# EAGLE design mother_board_PLA_4 (EAGLE 9.0.0)
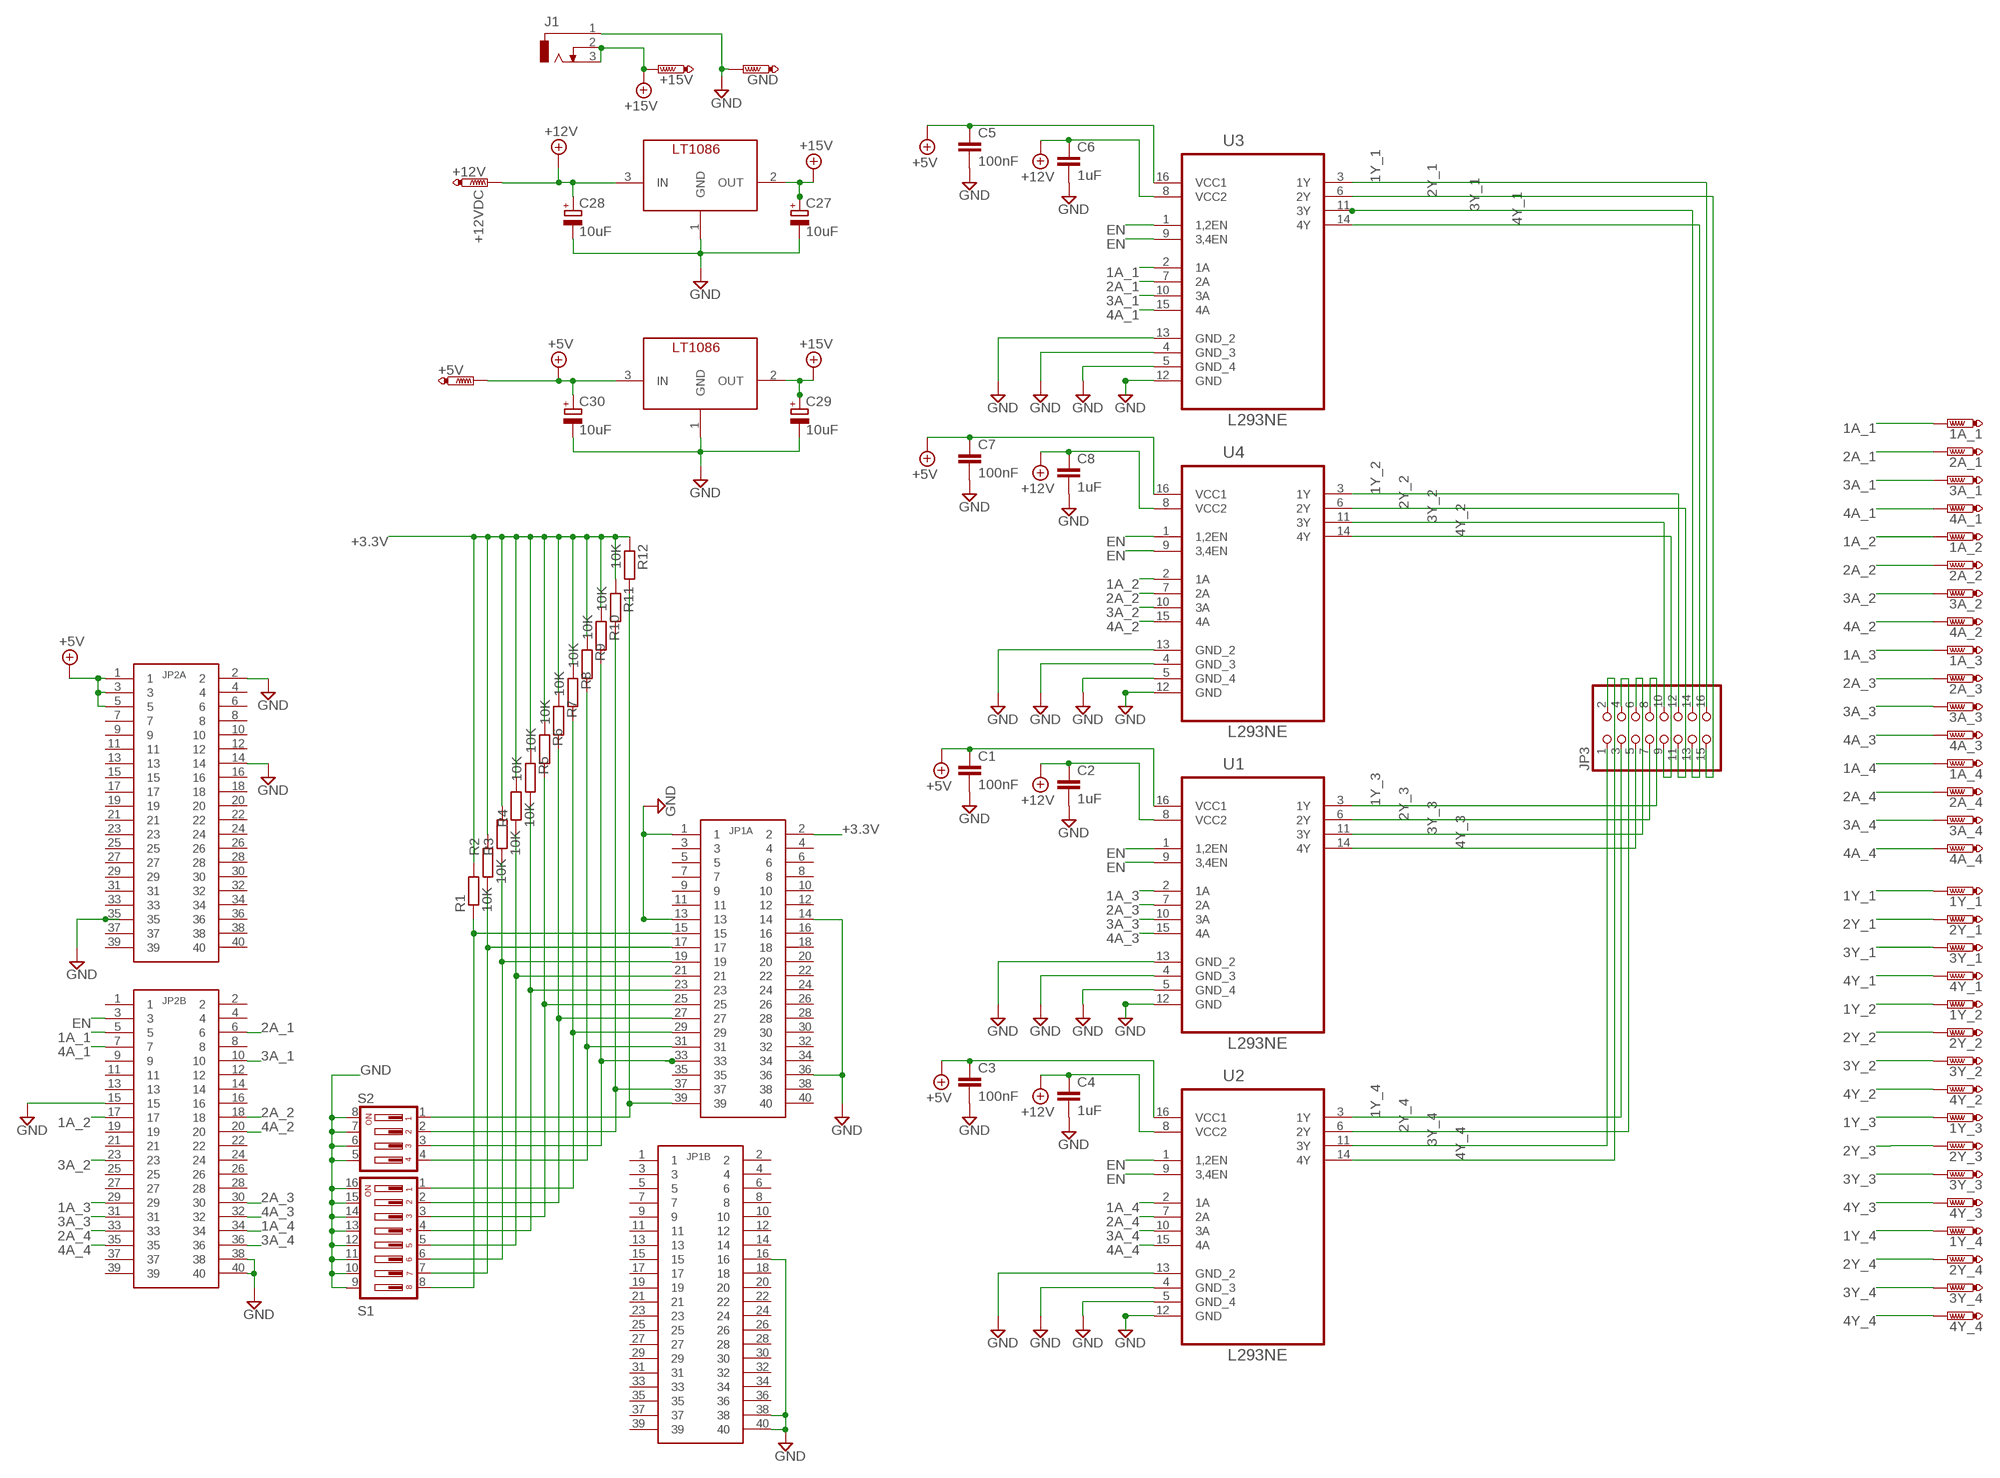
[diagram p0: schematic, sheet 1]

## Parts
1A_1  PTR1PAD1-20Y  [P1-20Y]
1A_2  PTR1PAD1-20Y  [P1-20Y]
1A_3  PTR1PAD1-20Y  [P1-20Y]
1A_4  PTR1PAD1-20Y  [P1-20Y]
1Y_1  PTR1PAD1-20Y  [P1-20Y]
1Y_2  PTR1PAD1-20Y  [P1-20Y]
1Y_3  PTR1PAD1-20Y  [P1-20Y]
1Y_4  PTR1PAD1-20Y  [P1-20Y]
2A_1  PTR1PAD1-20Y  [P1-20Y]
2A_2  PTR1PAD1-20Y  [P1-20Y]
2A_3  PTR1PAD1-20Y  [P1-20Y]
2A_4  PTR1PAD1-20Y  [P1-20Y]
2Y_1  PTR1PAD1-20Y  [P1-20Y]
2Y_2  PTR1PAD1-20Y  [P1-20Y]
2Y_3  PTR1PAD1-20Y  [P1-20Y]
2Y_4  PTR1PAD1-20Y  [P1-20Y]
3A_1  PTR1PAD1-20Y  [P1-20Y]
3A_2  PTR1PAD1-20Y  [P1-20Y]
3A_3  PTR1PAD1-20Y  [P1-20Y]
3A_4  PTR1PAD1-20Y  [P1-20Y]
3Y_1  PTR1PAD1-20Y  [P1-20Y]
3Y_2  PTR1PAD1-20Y  [P1-20Y]
3Y_3  PTR1PAD1-20Y  [P1-20Y]
3Y_4  PTR1PAD1-20Y  [P1-20Y]
4A_1  PTR1PAD1-20Y  [P1-20Y]
4A_2  PTR1PAD1-20Y  [P1-20Y]
4A_3  PTR1PAD1-20Y  [P1-20Y]
4A_4  PTR1PAD1-20Y  [P1-20Y]
4Y_1  PTR1PAD1-20Y  [P1-20Y]
4Y_2  PTR1PAD1-20Y  [P1-20Y]
4Y_3  PTR1PAD1-20Y  [P1-20Y]
4Y_4  PTR1PAD1-20Y  [P1-20Y]
+5V  PTR1PAD1-20Y  [P1-20Y]
+12V  PTR1PAD1-20Y  [P1-20Y]
+15V  PTR1PAD1-20Y  [P1-20Y]
C1  100nF  C-EU050-030X075  [C050-030X075]
C2  1uF  C-EU050-030X075  [C050-030X075]
C3  100nF  C-EU050-030X075  [C050-030X075]
C4  1uF  C-EU050-030X075  [C050-030X075]
C5  100nF  C-EU050-030X075  [C050-030X075]
C6  1uF  C-EU050-030X075  [C050-030X075]
C7  100nF  C-EU050-030X075  [C050-030X075]
C8  1uF  C-EU050-030X075  [C050-030X075]
C27  10uF  CPOL-EUE5-10.5  [E5-10,5]
C28  10uF  CPOL-EUE5-10.5  [E5-10,5]
C29  10uF  CPOL-EUE5-10.5  [E5-10,5]
C30  10uF  CPOL-EUE5-10.5  [E5-10,5]
GND  PTR1PAD1-20Y  [P1-20Y]
J1  DCJ0303  [DCJ0303]
JP1A  PIN_HEADER_2MM  [PIN_HEADER_2MM]
JP1B  PIN_HEADER_2MM  [PIN_HEADER_2MM]
JP2A  PIN_HEADER_2MM  [PIN_HEADER_2MM]
JP2B  PIN_HEADER_2MM  [PIN_HEADER_2MM]
JP3  PINHD-2X8  [2X08]
R1  10K  R-EU_0207/10  [0207/10]
R2  10K  R-EU_0207/10  [0207/10]
R3  10K  R-EU_0207/10  [0207/10]
R4  10K  R-EU_0207/10  [0207/10]
R5  10K  R-EU_0207/10  [0207/10]
R6  10K  R-EU_0207/10  [0207/10]
R7  10K  R-EU_0207/10  [0207/10]
R8  10K  R-EU_0207/10  [0207/10]
R9  10K  R-EU_0207/10  [0207/10]
R10  10K  R-EU_0207/10  [0207/10]
R11  10K  R-EU_0207/10  [0207/10]
R12  10K  R-EU_0207/10  [0207/10]
S1  DIP04YL  [DIP04YL]
S2  DIP08YL  [DIP08YL]
U1  L293NE  [DIP254P762X508-16]
U2  L293NE  [DIP254P762X508-16]
U3  L293NE  [DIP254P762X508-16]
U4  L293NE  [DIP254P762X508-16]
U$4  LT1086LT1086-V  [TO220_VERTICAL]
U$6  LT1086LT1086-V  [TO220_VERTICAL]

## Nets
1A_1: 1A_1.TP JP2B.5 U3.2(1A)
1A_2: 1A_2.TP JP2B.17 U4.2(1A)
1A_3: 1A_3.TP JP2B.29 U1.2(1A)
1A_4: 1A_4.TP JP2B.34 U2.2(1A)
1Y_1: 1Y_1.TP JP3.16 U3.3(1Y)
1Y_2: 1Y_2.TP JP3.12 U4.3(1Y)
1Y_3: 1Y_3.TP JP3.8 U1.3(1Y)
1Y_4: 1Y_4.TP JP3.3 U2.3(1Y)
2A_1: 2A_1.TP JP2B.6 U3.7(2A)
2A_2: 2A_2.TP JP2B.18 U4.7(2A)
2A_3: 2A_3.TP JP2B.30 U1.7(2A)
2A_4: 2A_4.TP JP2B.33 U2.7(2A)
2Y_1: 2Y_1.TP JP3.15 U3.6(2Y)
2Y_2: 2Y_2.TP JP3.11 U4.6(2Y)
2Y_3: 2Y_3.TP JP3.7 U1.6(2Y)
2Y_4: 2Y_4.TP JP3.4 U2.6(2Y)
3A_1: 3A_1.TP JP2B.10 U3.10(3A)
3A_2: 3A_2.TP JP2B.23 U4.10(3A)
3A_3: 3A_3.TP JP2B.31 U1.10(3A)
3A_4: 3A_4.TP JP2B.36 U2.10(3A)
3Y_1: 3Y_1.TP JP3.14 U3.11(3Y)
3Y_2: 3Y_2.TP JP3.10 U4.11(3Y)
3Y_3: 3Y_3.TP JP3.6 U1.11(3Y)
3Y_4: 3Y_4.TP JP3.1 U2.11(3Y)
4A_1: 4A_1.TP JP2B.7 U3.15(4A)
4A_2: 4A_2.TP JP2B.20 U4.15(4A)
4A_3: 4A_3.TP JP2B.32 U1.15(4A)
4A_4: 4A_4.TP JP2B.35 U2.15(4A)
4Y_1: 4Y_1.TP JP3.13 U3.14(4Y)
4Y_2: 4Y_2.TP JP3.9 U4.14(4Y)
4Y_3: 4Y_3.TP JP3.5 U1.14(4Y)
4Y_4: 4Y_4.TP JP3.2 U2.14(4Y)
+3.3V: JP1A.2 R1.2 R2.2 R3.2 R4.2 R5.1 R6.1 R7.1 R8.1 R9.1 R10.1 R11.1 R12.1
+5V: +5V.TP C1.1 C3.1 C5.1 C7.1 C30.+ JP2A.1 JP2A.3 JP2A.5 U1.16(VCC1) U2.16(VCC1) U3.16(VCC1) U4.16(VCC1) U$4.3(IN)
+12V: +12V.TP C2.1 C4.1 C6.1 C8.1 C28.+ U1.8(VCC2) U2.8(VCC2) U3.8(VCC2) U4.8(VCC2) U$6.3(IN)
+15V: +15V.TP C27.+ C29.+ J1.2 J1.3 U$4.2(OUT) U$6.2(OUT)
EN: JP2B.3 U1.1(1,2EN) U1.9(3,4EN) U2.1(1,2EN) U2.9(3,4EN) U3.1(1,2EN) U3.9(3,4EN) U4.1(1,2EN) U4.9(3,4EN)
GND: C1.2 C2.2 C3.2 C4.2 C5.2 C6.2 C7.2 C8.2 C27.- C28.- C29.- C30.- GND.TP J1.1 JP1A.1 JP1A.13 JP1A.14 JP1A.36 JP1B.16 JP1B.38 JP1B.40 JP2A.2 JP2A.14 JP2A.35 JP2B.15 JP2B.38 JP2B.40 S1.5 S1.6 S1.7 S1.8 S2.9 S2.10 S2.11 S2.12 S2.13 S2.14 S2.15 S2.16 U1.4(GND_3) U1.5(GND_4) U1.12(GND) U1.13(GND_2) U2.4(GND_3) U2.5(GND_4) U2.12(GND) U2.13(GND_2) U3.4(GND_3) U3.5(GND_4) U3.12(GND) U3.13(GND_2) U4.4(GND_3) U4.5(GND_4) U4.12(GND) U4.13(GND_2) U$4.1(GND) U$6.1(GND)
N$1: JP1A.37 R11.2 S1.2
N$2: JP1A.39 R12.2 S1.1
N$3: JP1A.33 R10.2 S1.3
N$4: JP1A.31 R9.2 S1.4
N$5: JP1A.15 R1.1 S2.8
N$6: JP1A.17 R2.1 S2.7
N$7: JP1A.19 R3.1 S2.6
N$8: JP1A.21 R4.1 S2.5
N$9: JP1A.23 R5.2 S2.4
N$10: JP1A.25 R6.2 S2.3
N$11: JP1A.27 R7.2 S2.2
N$12: JP1A.29 R8.2 S2.1
Unconnected: JP1A.3 JP1A.4 JP1A.5 JP1A.6 JP1A.7 JP1A.8 JP1A.9 JP1A.10 JP1A.11 JP1A.12 JP1A.16 JP1A.18 JP1A.20 JP1A.22 JP1A.24 JP1A.26 JP1A.28 JP1A.30 JP1A.32 JP1A.34 JP1A.35 JP1A.38 JP1A.40 JP1B.1 JP1B.2 JP1B.3 JP1B.4 JP1B.5 JP1B.6 JP1B.7 JP1B.8 JP1B.9 JP1B.10 JP1B.11 JP1B.12 JP1B.13 JP1B.14 JP1B.15 JP1B.17 JP1B.18 JP1B.19 JP1B.20 JP1B.21 JP1B.22 JP1B.23 JP1B.24 JP1B.25 JP1B.26 JP1B.27 JP1B.28 JP1B.29 JP1B.30 JP1B.31 JP1B.32 JP1B.33 JP1B.34 JP1B.35 JP1B.36 JP1B.37 JP1B.39 JP2A.4 JP2A.6 JP2A.7 JP2A.8 JP2A.9 JP2A.10 JP2A.11 JP2A.12 JP2A.13 JP2A.15 JP2A.16 JP2A.17 JP2A.18 JP2A.19 JP2A.20 JP2A.21 JP2A.22 JP2A.23 JP2A.24 JP2A.25 JP2A.26 JP2A.27 JP2A.28 JP2A.29 JP2A.30 JP2A.31 JP2A.32 JP2A.33 JP2A.34 JP2A.36 JP2A.37 JP2A.38 JP2A.39 JP2A.40 JP2B.1 JP2B.2 JP2B.4 JP2B.8 JP2B.9 JP2B.11 JP2B.12 JP2B.13 JP2B.14 JP2B.16 JP2B.19 JP2B.21 JP2B.22 JP2B.24 JP2B.25 JP2B.26 JP2B.27 JP2B.28 JP2B.37 JP2B.39

## Library data of the parts
1A_1-1A_4 1Y_1-1Y_4 2A_1-2A_4 2Y_1-2Y_4 3A_1-3A_4 3Y_1-3Y_4 4A_1-4A_4 4Y_1-4Y_4 +5V +15V GND = testpad:PTR1: TEST PIN; SPICEPREFIX: X
+12V = testpad:PTR1: TEST PIN; SPICEPREFIX: X; TP_SIGNAL_NAME: +12VDC
C1 C4-C6 = rcl:C-EU: CAPACITOR, European symbol; SPICEPREFIX: C
C2 C3 = rcl:C-EU: CAPACITOR, European symbol
C7 = rcl:C-EU: CAPACITOR, European symbol; SPICEPREFIX: 100n
C8 = rcl:C-EU: CAPACITOR, European symbol; SPICEPREFIX: 1uF
C27-C30 = rcl:CPOL-EU: POLARIZED CAPACITOR, European symbol; SPICEPREFIX: C
J1 = con-jack:DCJ0303: DC POWER JACK Source: DCJ0303.pdf; OC_FARNELL: unknown; OC_NEWARK: unknown
JP1A JP1B JP2A JP2B = header_2x20_2mm:PIN_HEADER_2MM
JP3 = pinhead:PINHD-2X8: PIN HEADER
R1-R12 = resistor:R-EU_: RESISTOR, European symbol
S1 = switch-dil:DIP04YL: DIL/CODE SWITCH; OC_FARNELL: unknown; OC_NEWARK: unknown
S2 = switch-dil:DIP08YL: DIL/CODE SWITCH; OC_FARNELL: unknown; OC_NEWARK: unknown
U1-U4 = Texas_Instruments_By_element14_Batch_1:L293NE: QUADRUPLE HALF-H DRIVERS; MPN: L293NE; OC_FARNELL: -; OC_NEWARK: 06F9524; PACKAGE: PDIP-16; SUPPLIER: Texas Instruments
U$4 U$6 = LT1086:LT1086

## Board
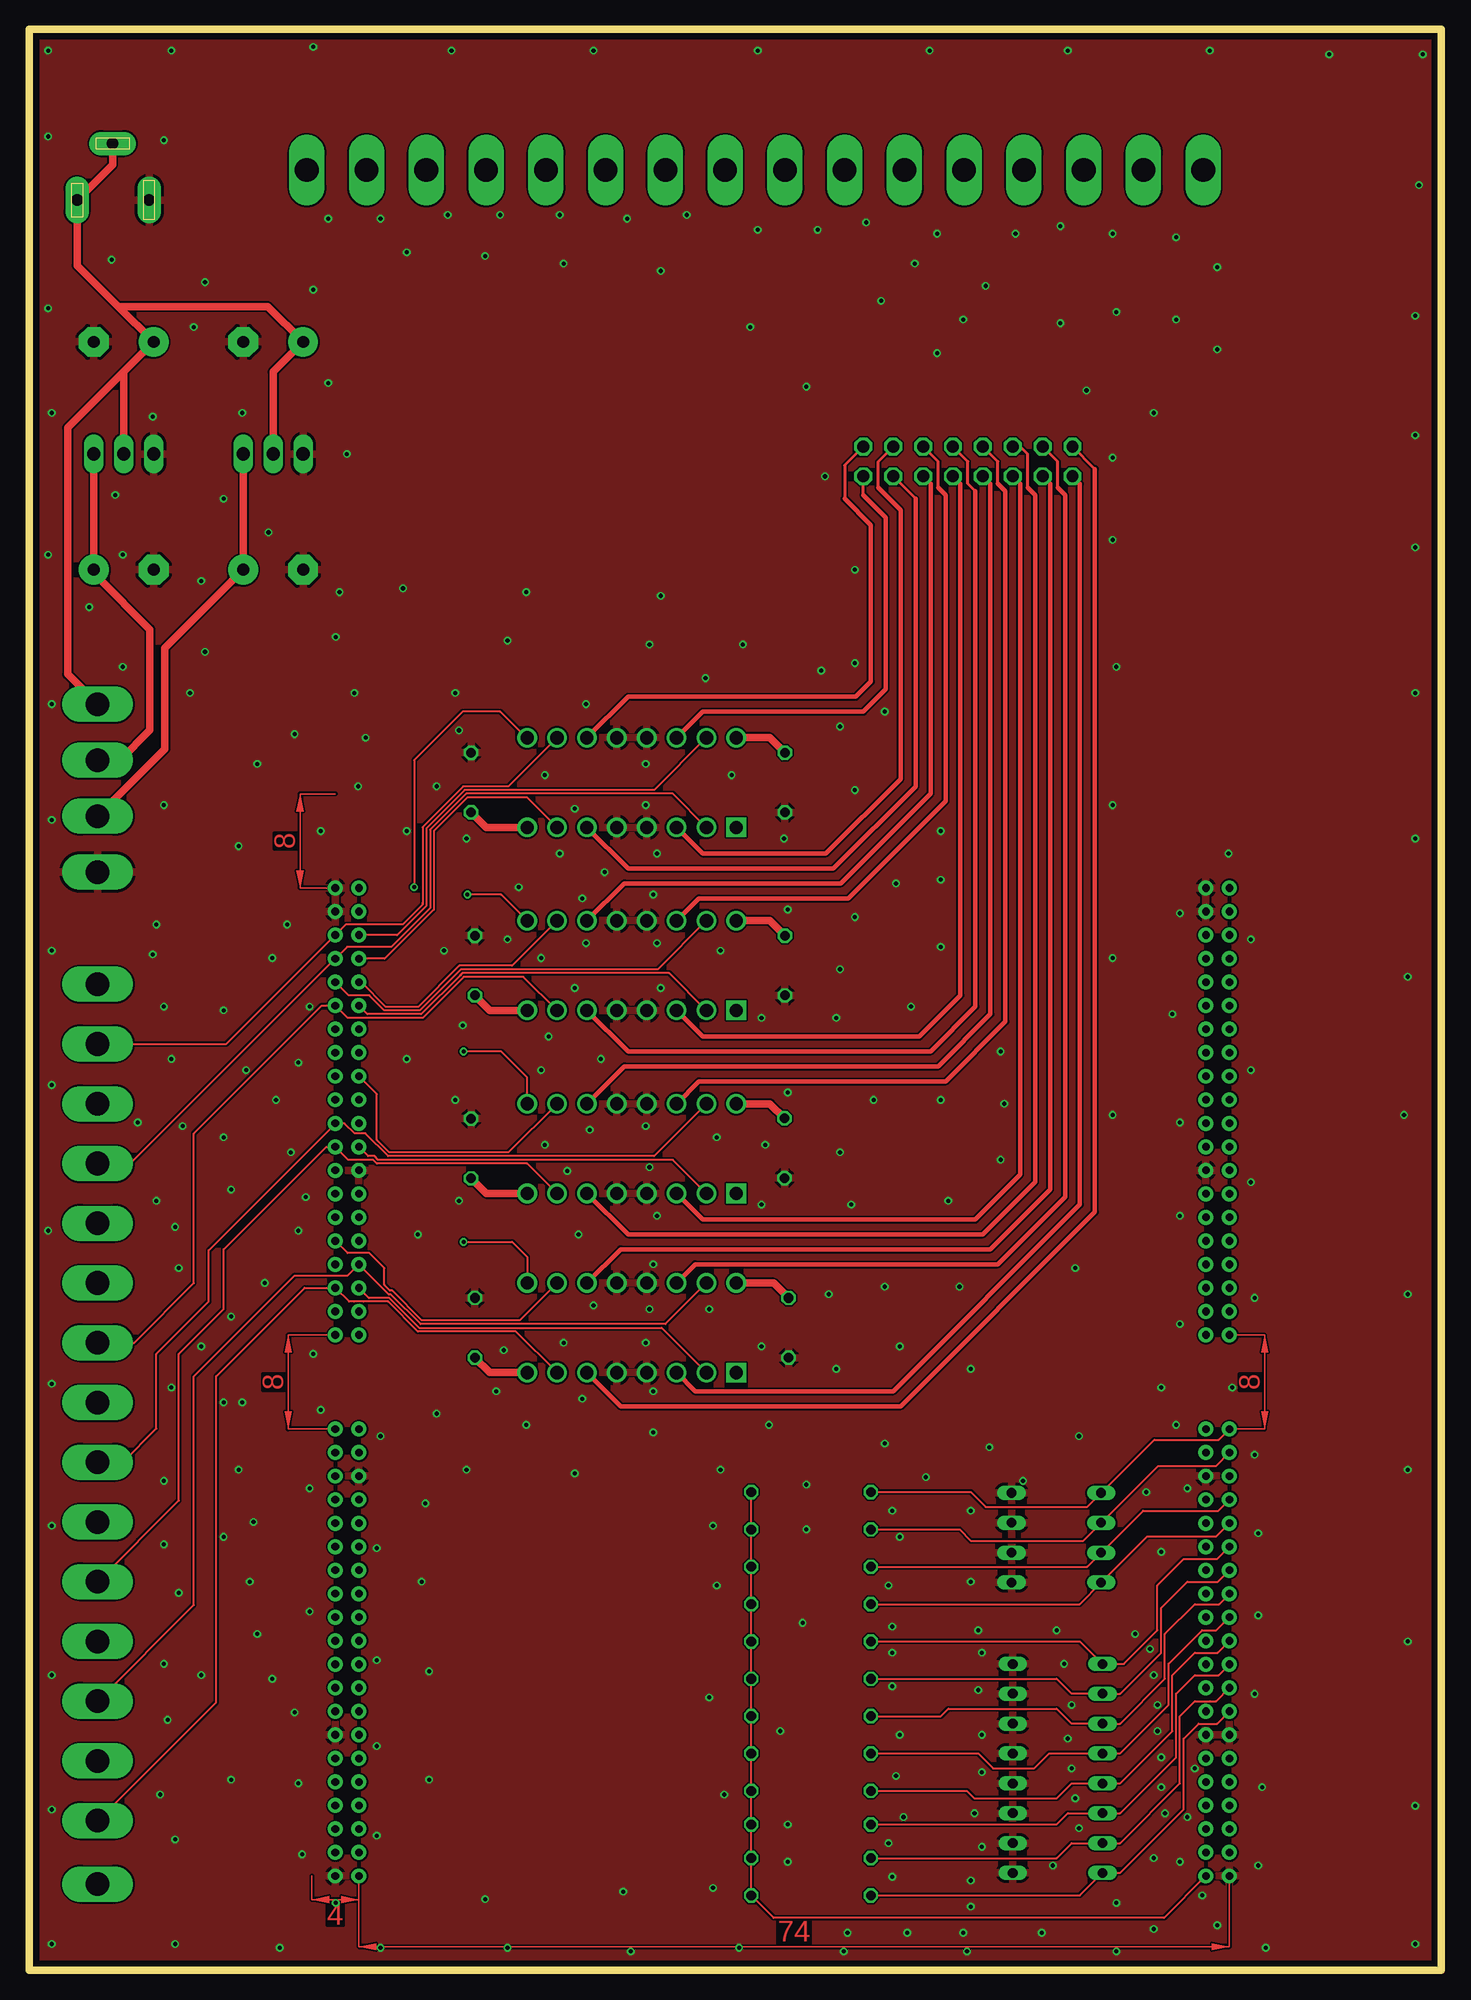
[diagram p1: board, top side]
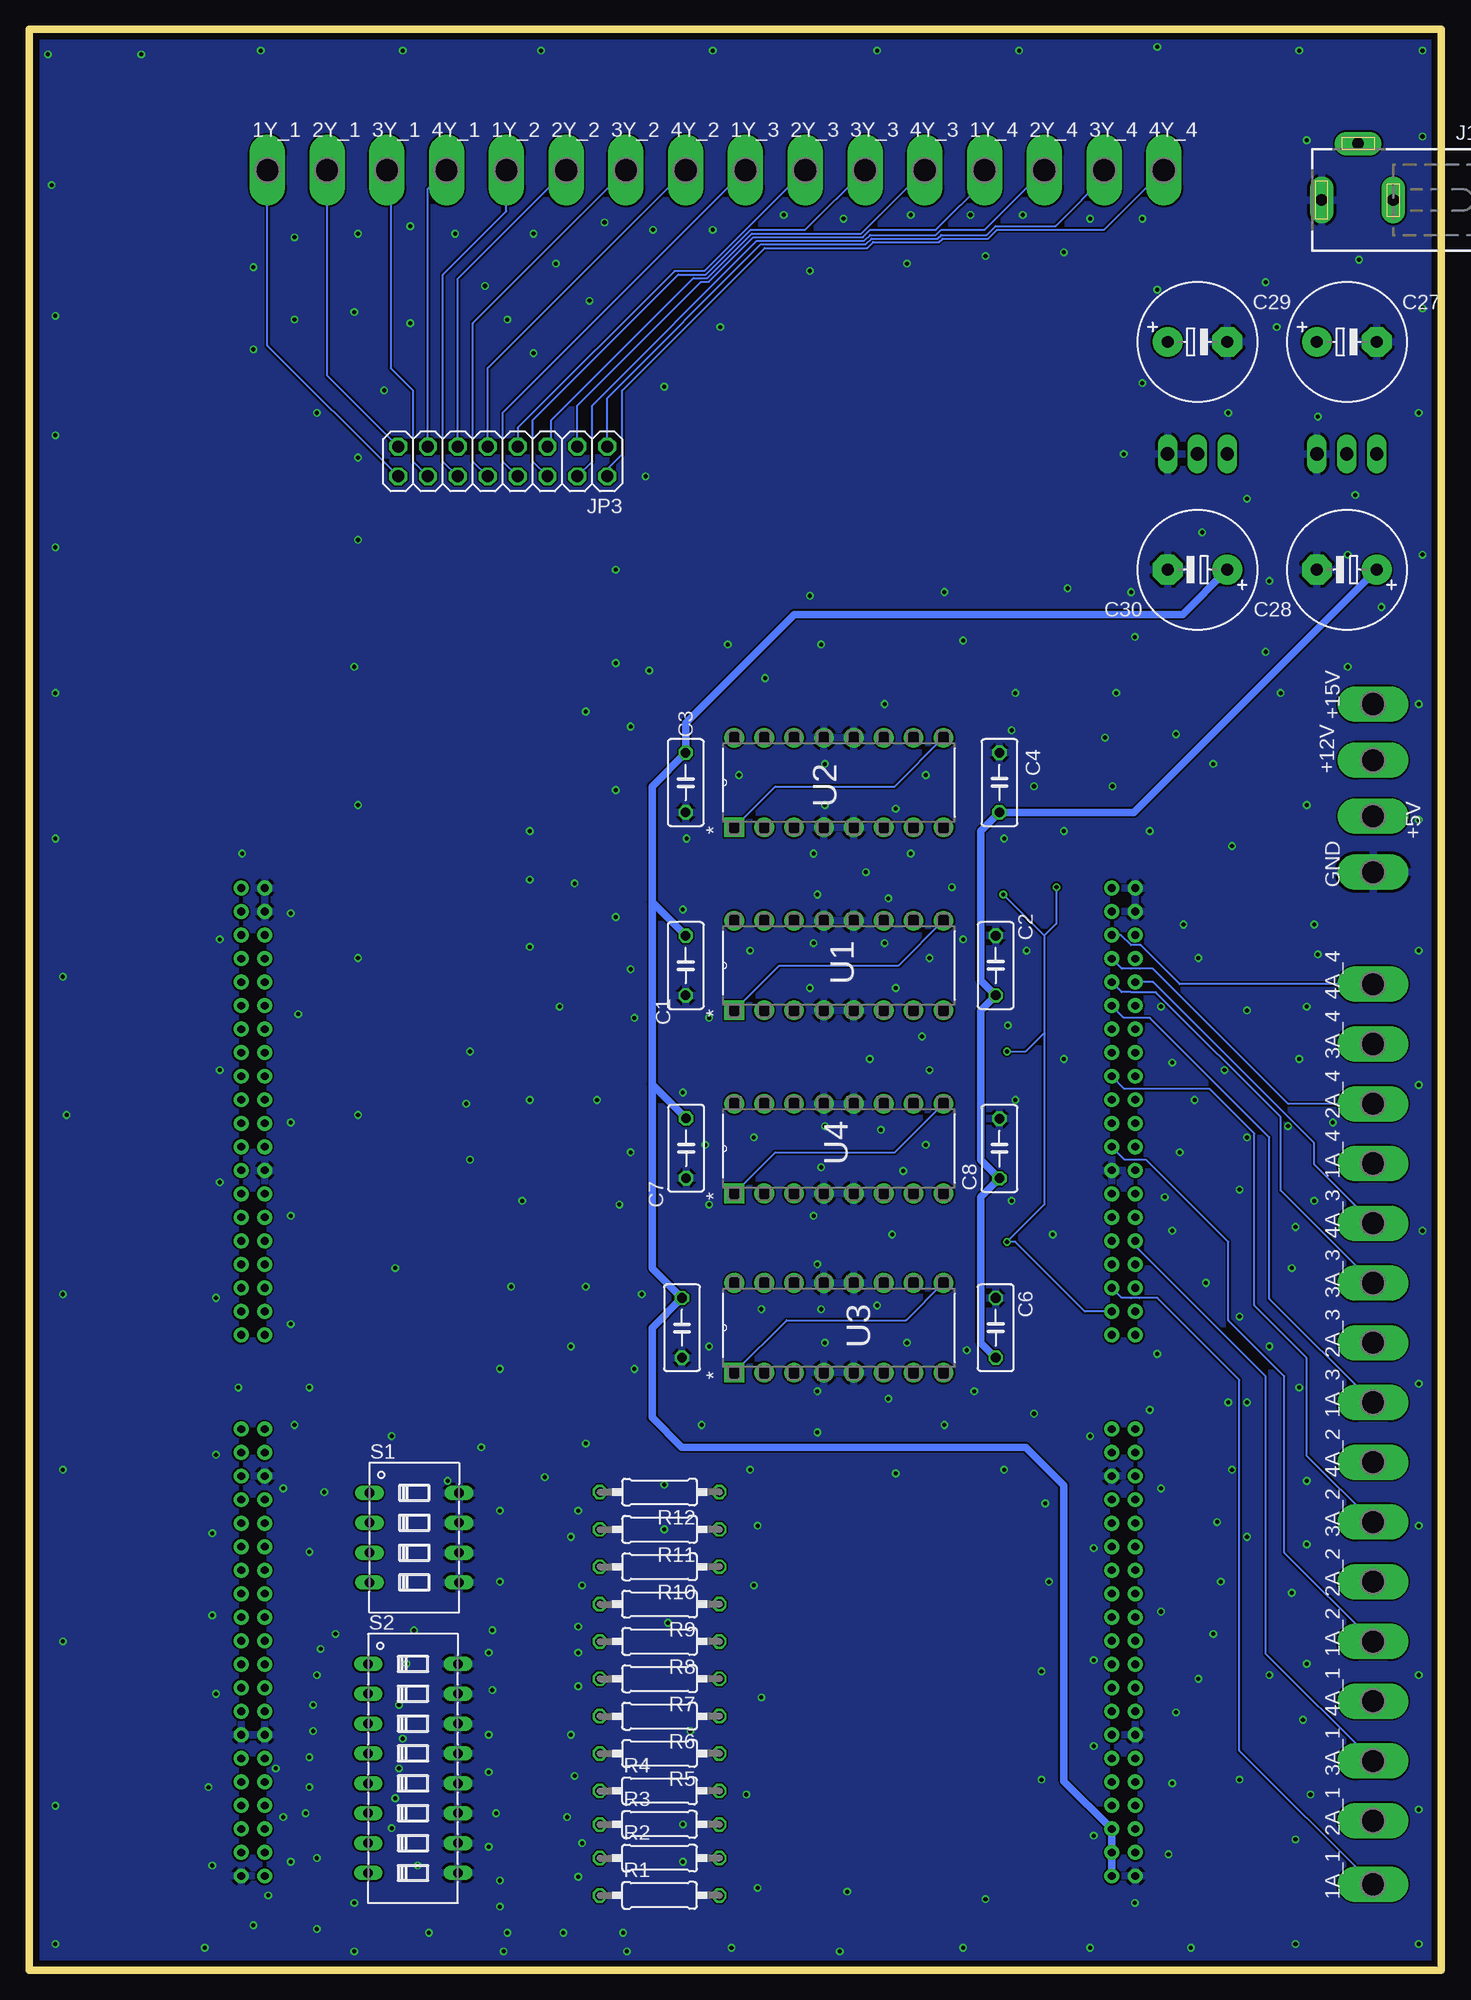
[diagram p2: board, bottom side, seen from below]

Size 120 x 165 mm. Coordinates in mm from the lower left corner, seen from the top.
Outline: 0,0 120,0 120,165 0,165 0,0
Copper layers (1*16): Top 0.035mm / dielectric 1.6mm / Bottom 0.035mm
Design rules "Elecrow_2-layer_PCB_eagle_rule": minimum track width 6mil, minimum drill 12mil, track to track 6mil, track to pad 6mil, pad to pad 6mil, via to via 8mil, smd to smd 0mil, copper to edge 20mil, drill to drill 10mil, minimum pad ring 6mil, minimum via ring 6mil, stop-mask expansion 0mil, vias tented up to drill 100mil, thermal gap 10mil

### Footprints (pad centres in the part's own frame; a part is rotated, then mirrored left to right if it is on the bottom)
P1-20Y = drill 2.007 pad 2.54 long: TP 0,0
C050-030X075 = drill 0.813 octagon: 1 -2.54,0; 2 2.54,0
E5-10,5 = drill 1.016 pad 2.54: + -2.54,0 | drill 1.016 pad 2.54 octagon: - 2.54,0
DCJ0303 = drill 1 pad 2 long: 1 0,3.1; 2 4.8,0; 3 0,-3
PIN_HEADER_2MM = drill 0.65 pad 1.27: 1 -2,38; 2 0,38; 3 -2,36; 4 0,36; 5 -2,34; 6 0,34; 7 -2,32; 8 0,32; 9 -2,30; 10 0,30; 11 -2,28; 12 0,28; 13 -2,26; 14 0,26; 15 -2,24; 16 0,24; 17 -2,22; 18 0,22; 19 -2,20; 20 0,20; 21 -2,18; 22 0,18; 23 -2,16; 24 0,16; 25 -2,14; 26 0,14; 27 -2,12; 28 0,12; 29 -2,10; 30 0,10; 31 -2,8; 32 0,8; 33 -2,6; 34 0,6; 35 -2,4; 36 0,4; 37 -2,2; 38 0,2; 39 -2,0; 40 0,0
2X08 = drill 1.016 octagon: 1 -8.89,-1.27; 2 -8.89,1.27; 3 -6.35,-1.27; 4 -6.35,1.27; 5 -3.81,-1.27; 6 -3.81,1.27; 7 -1.27,-1.27; 8 -1.27,1.27; 9 1.27,-1.27; 10 1.27,1.27; 11 3.81,-1.27; 12 3.81,1.27; 13 6.35,-1.27; 14 6.35,1.27; 15 8.89,-1.27; 16 8.89,1.27
0207/10 = drill 0.813 octagon: 1 -5.08,0; 2 5.08,0
DIP04YL = drill 0.813 long: 1 -3.81,-3.81; 2 -1.27,-3.81; 3 1.27,-3.81; 4 3.81,-3.81; 5 3.81,3.81; 6 1.27,3.81; 7 -1.27,3.81; 8 -3.81,3.81
DIP08YL = drill 0.813 long: 1 -8.89,-3.81; 2 -6.35,-3.81; 3 -3.81,-3.81; 4 -1.27,-3.81; 5 1.27,-3.81; 6 3.81,-3.81; 7 6.35,-3.81; 8 8.89,-3.81; 9 8.89,3.81; 10 6.35,3.81; 11 3.81,3.81; 12 1.27,3.81; 13 -1.27,3.81; 14 -3.81,3.81; 15 -6.35,3.81; 16 -8.89,3.81
DIP254P762X508-16 = drill 1.118 square: 1 -7.62,17.78 | drill 1.118: 2 -7.62,15.24; 3 -7.62,12.7; 4 -7.62,10.16; 5 -7.62,7.62; 6 -7.62,5.08; 7 -7.62,2.54; 8 -7.62,0; 9 0,0; 10 0,2.54; 11 0,5.08; 12 0,7.62; 13 0,10.16; 14 0,12.7; 15 0,15.24; 16 0,17.78
TO220_VERTICAL = drill 1.118 long: 1 0,0; 2 2.54,0; 3 5.08,0

### Placement (x,y rotation side)
1A_1  5.79,7.3 90 bottom
1A_2  5.79,27.94 90 bottom
1A_3  5.79,48.26 90 bottom
1A_4  5.79,68.58 90 bottom
1Y_1  99.78,153.03 0 bottom
1Y_2  79.45,153.03 0 bottom
1Y_3  59.13,153.03 0 bottom
1Y_4  38.81,153.03 0 bottom
2A_1  5.79,12.7 90 bottom
2A_2  5.79,33.02 90 bottom
2A_3  5.79,53.34 90 bottom
2A_4  5.79,73.66 90 bottom
2Y_1  94.69,153.03 0 bottom
2Y_2  74.38,153.03 0 bottom
2Y_3  54.05,153.03 0 bottom
2Y_4  33.73,153.03 0 bottom
3A_1  5.79,17.78 90 bottom
3A_2  5.79,38.1 90 bottom
3A_3  5.79,58.42 90 bottom
3A_4  5.79,78.74 90 bottom
3Y_1  89.61,153.03 0 bottom
3Y_2  69.3,153.03 0 bottom
3Y_3  48.98,153.03 0 bottom
3Y_4  28.66,153.03 0 bottom
4A_1  5.79,22.86 90 bottom
4A_2  5.79,43.18 90 bottom
4A_3  5.79,63.5 90 bottom
4A_4  5.79,83.82 90 bottom
4Y_1  84.53,153.03 0 bottom
4Y_2  64.22,153.03 0 bottom
4Y_3  43.9,153.03 0 bottom
4Y_4  23.57,153.03 0 bottom
+5V  5.79,98.11 270 bottom
+12V  5.79,102.87 90 bottom
+15V  5.79,107.63 90 bottom
C1  64.22,85.41 270 bottom
C2  37.86,85.41 90 bottom
C3  64.22,100.97 270 bottom
C4  37.55,100.97 90 bottom
C5  64.53,54.61 270 bottom
C6  37.86,54.61 90 bottom
C7  64.18,69.88 270 bottom
C8  37.55,69.85 90 bottom
C27  8.02,138.43 0 bottom
C28  8.02,119.06 180 bottom
C29  20.72,138.43 0 bottom
C30  20.72,119.06 180 bottom
GND  5.79,93.34 90 bottom
J1  7.07,150.5 90 bottom
JP1A  100,46 180 top
JP1B  100,92 180 top
JP2A  26,46 180 top
JP2B  26,92 180 top
JP3  79.77,128.27 180 bottom
R1  66.44,6.35 0 bottom
R2  66.44,9.53 0 bottom
R3  66.44,12.38 0 bottom
R4  66.44,15.24 0 bottom
R5  66.44,18.41 180 bottom
R6  66.44,21.59 180 bottom
R7  66.44,24.77 180 bottom
R8  66.44,27.94 180 bottom
R9  66.44,31.11 180 bottom
R10  66.44,34.29 180 bottom
R11  66.44,37.47 180 bottom
R12  66.44,40.64 180 bottom
S1  87.29,36.76 270 bottom
S2  87.39,17.14 270 bottom
U1  42.31,89.22 90 bottom
U2  42.31,104.78 90 bottom
U3  42.31,58.42 90 bottom
U4  42.31,73.66 90 bottom
U$4  23.26,128.91 0 bottom
U$6  10.56,128.91 0 bottom

### Tracks (layer width: path | path; a pad name or v marks a point on that pad's centre or on a via)
1A_1
  Top 0.152: U3.2 53.74,54.61 33.13,54.61 30.61,57.14 28.86,57.14 JP2B.5
  Bottom 0.152: 1A_1.TP 17.14,18.65 17.14,50.16 24.13,57.15 25.63,57.15 25.64,57.14 26.36,57.14 26.37,57.15 27.15,57.15 JP2B.5
1A_2
  Top 0.152: U4.2 54.69,68.9 29.64,68.9 29.34,69.2 28.8,69.2 JP2B.17
  Bottom 0.152: 1A_2.TP 13.34,35.48 13.34,50.48 18.1,55.24 18.1,61.91 25.08,68.9 26.9,68.9 JP2B.17
1A_3
  Top 0.152: U1.2 54.37,84.77 36.8,84.77 36.78,84.76 36.69,84.67 36.6,84.58 | 36.6,84.58 | JP2B.29 28.72,81.28 33.3,81.28 36.6,84.58
  Bottom 0.152: 1A_3.TP 14.61,57.07 14.61,70.8 24.77,80.96 26.96,80.96 JP2B.29
1A_4
  Top 0.152: U2.2 54.69,100.01 37.11,100.01 34.05,96.95 34.05,90.28 30.76,87 27,87 JP2B.34 8.58,68.58 1A_4.TP 7.81,68.58
1Y_1
  Top 0.254: 89.3,126.36 JP3.16
  Top 0.381: U3.3 56.59,49.21 73.42,49.21 89.3,65.09 89.3,126.36
  Bottom 0.152: JP3.16 99.78,138.11 1Y_1.TP
1Y_2
  Top 0.254: 84.22,126.36 JP3.12
  Top 0.381: U4.3 57.23,63.82 80.41,63.82 84.22,67.63 84.22,126.36
  Bottom 0.152: JP3.12 84.85,128.27 84.85,144.15 79.45,149.54 1Y_2.TP
1Y_3
  Top 0.254: 79.14,126.36 JP3.8
  Top 0.381: U1.3 57.23,79.38 75.64,79.38 79.14,82.87 79.14,126.36
  Bottom 0.152: JP3.8 79.77,128.27 79.77,132.4 1Y_3.TP
1Y_4
  Top 0.254: 72.15,126.05 72.15,128.27 JP3.3
  Top 0.381: U2.3 57.23,94.93 67.71,94.93 74.06,101.28 74.06,124.14 72.15,126.05
  Bottom 0.152: JP3.3 73.42,133.03 62.91,143.55 62.25,143.55 58.46,147.33 49.17,147.33 48.54,147.96 42.94,147.96 38.81,152.08 1Y_4.TP
2A_1
  Top 0.152: U3.7 41.35,54.29 33.02,54.29 30.48,56.83 28.39,56.83 28.36,56.86 27.64,56.86 27.61,56.83 27.17,56.83 JP2B.6 23.39,58 15.88,50.48 15.88,22.78 2A_1.TP
2A_2
  Top 0.152: U4.7 42.31,68.58 29.53,68.58 29.21,68.9 27.1,68.9 JP2B.18 25.23,70 16.51,61.28 16.51,56.2 12.7,52.39 12.7,39.92 2A_2.TP
2A_3
  Top 0.152: U1.7 41.99,84.45 36.91,84.45 33.42,80.96 27.04,80.96 JP2B.30 24.85,82 13.97,71.12 13.97,58.42 8.89,53.34 2A_3.TP 8.57,53.34
2A_4
  Top 0.152: U2.7 42.31,99.69 37.23,99.69 34.37,96.84 34.37,90.17 30.2,86 JP2B.33
  Bottom 0.152: 26.36,85.14 | 26.36,85.14 25.64,85.14 24.5,85.14 13.02,73.66 2A_4.TP | 26.36,85.14 27.14,85.14 JP2B.33
2Y_1
  Top 0.254: 90.57,127.64 JP3.15
  Top 0.381: U3.6 50.24,47.94 74.06,47.94 90.57,64.45 90.57,127.64
  Bottom 0.152: JP3.15 94.69,135.57 2Y_1.TP
2Y_2
  Top 0.254: 84.85,126.05 84.85,128.91 84.22,129.54 JP3.11
  Top 0.381: U4.6 50.88,62.55 81.04,62.55 85.49,66.99 85.49,125.41 84.85,126.05
  Bottom 0.152: JP3.11 83.58,143.83 2Y_2.TP
2Y_3
  Top 0.254: 80.41,125.73 79.77,126.36 79.77,128.27 JP3.7
  Top 0.381: U1.6 50.88,78.11 76.6,78.11 80.41,81.92 80.41,125.73
  Bottom 0.152: JP3.7 78.5,131.13 65.17,144.46 62.63,144.46 2Y_3.TP
2Y_4
  Top 0.254: 75.33,125.09 JP3.4
  Top 0.381: U2.6 50.88,93.66 68.34,93.66 75.33,100.65 75.33,125.09
  Bottom 0.152: JP3.4 72.15,128.27 72.15,133.03 58.16,147.03 49.04,147.03 48.54,147.52 42.94,147.52 42.51,147.96 38.81,147.96 2Y_4.TP
3A_1
  Top 0.152: U3.10 41.67,55.24 33.36,55.24 30.82,57.78 30.65,57.78 30.16,58.27 30.16,59.69 28.89,60.96 27.04,60.96 JP2B.10
  Bottom 0.152: 3A_1.TP 14.92,26.91 14.92,50.48 26,61.56 JP2B.10
3A_2
  Top 0.152: U4.10 40.72,69.53 30.59,69.53 29.53,70.6 29.53,74.47 JP2B.23
  Bottom 0.152: 8.26,38.1 3A_2.TP 11.43,43.73 11.43,52.07 15.88,56.52 15.88,71.12 19.68,74.93 26.93,74.93 JP2B.23
3A_3
  Top 0.152: U1.10 41.02,85.39 36.55,85.39 33.06,81.9 30.29,81.9 28.19,84 JP2B.31
  Bottom 0.152: 3A_3.TP 13.65,66.28 13.65,72.54 24.25,83.14 26.36,83.14 26.38,83.16 27.16,83.16 JP2B.31
3A_4
  Top 0.152: U2.10 40.71,100.64 36.87,100.64 33.42,97.18 33.42,90.72 33.43,90.71 33.43,90.6 31.73,88.9 26.9,88.9 JP2B.36 16.74,78.74 3A_4.TP
3Y_1
  Top 0.254: 86.76,126.36 JP3.14
  Top 0.381: U3.11 50.24,61.28 81.68,61.28 86.76,66.36 86.76,126.36
  Bottom 0.152: JP3.14 87.39,128.27 87.39,134.3 89.3,136.21 89.3,152.72 3Y_1.TP
3Y_2
  Top 0.254: 81.68,126.36 JP3.10
  Top 0.381: U4.11 50.56,76.83 77.23,76.83 81.68,81.28 81.68,126.36
  Bottom 0.152: JP3.10 82.31,128.27 82.31,140.02 3Y_2.TP
3Y_3
  Top 0.254: 76.6,126.36 JP3.6
  Top 0.381: U1.11 50.56,92.39 68.98,92.39 76.6,100.01 76.6,126.36
  Bottom 0.152: JP3.6 77.23,128.27 77.23,131.76 64.84,144.16 62.5,144.16 58.7,147.96 54.05,147.96 3Y_3.TP
3Y_4
  Top 0.254: 69.3,125.09 69.3,127.95 JP3.1
  Top 0.381: U2.11 50.88,108.27 70.25,108.27 71.52,109.54 71.52,122.87 69.3,125.09
  Bottom 0.152: JP3.1 70.88,133.67 57.83,146.72 48.91,146.72 48.42,147.22 42.82,147.22 42.51,147.52 38.61,147.52 37.86,148.27 32.78,148.27 28.34,152.72 3Y_4.TP
4A_1
  Top 0.152: U3.15 54.05,54.93 33.25,54.93 30.73,57.44 30.56,57.44 JP2B.7 27.05,59.05 22.54,59.05 13.97,50.48 13.97,31.04 4A_1.TP
4A_2
  Top 0.152: U4.15 53.1,69.22 30.48,69.22 28.56,71.14 27.64,71.14 26.78,72 26.04,72 | 26.04,72 JP2B.20 | 4A_2.TP 7.94,43.18 10.79,46.04 10.79,52.39 15.24,56.83 15.24,61.2 26.04,72
4A_3
  Top 0.152: U1.15 53.42,85.09 36.68,85.09 33.18,81.6 30.16,81.6 28.89,82.87 27.13,82.87 JP2B.32
  Bottom 0.152: 4A_3.TP 10.79,68.5 10.79,70.32 24.48,84 JP2B.32
4A_4
  Top 0.152: U2.15 53.1,100.33 37,100.33 33.75,97.08 33.75,96.85 33.73,96.84 33.73,90.72 33.75,90.71 33.75,90.49 31.26,88 JP2B.35
  Bottom 0.152: JP2B.35 27.22,88 26.36,87.14 25.54,87.14 22.23,83.82 4A_4.TP
4Y_1
  Top 0.254: 87.39,126.05 87.39,128.27 JP3.13
  Top 0.381: U3.14 56.59,60.01 82.31,60.01 88.03,65.72 88.03,125.41 87.39,126.05
  Bottom 0.152: JP3.13 86.12,151.45 4Y_1.TP
4Y_2
  Top 0.254: 82.31,126.36 82.31,128.27 JP3.9
  Top 0.381: U4.14 56.91,75.56 77.87,75.56 82.95,80.64 82.95,125.73 82.31,126.36
  Bottom 0.152: JP3.9 81.04,136.21 4Y_2.TP
4Y_3
  Top 0.254: 77.23,126.05 77.23,128.27 JP3.5
  Top 0.381: U1.14 56.91,91.12 69.61,91.12 77.87,99.38 77.87,125.41 77.23,126.05
  Bottom 0.152: JP3.5 75.64,129.86 75.64,131.76 63.55,143.85 62.38,143.85 58.59,147.64 49.29,147.64 4Y_3.TP
4Y_4
  Top 0.254: 70.88,125.41 JP3.2
  Top 0.381: U2.14 57.23,107 70.88,107 72.79,108.9 72.79,123.51 70.88,125.41
  Bottom 0.152: JP3.2 70.88,127.64 69.61,128.91 69.61,134.3 57.5,146.42 48.79,146.42 48.29,146.91 42.69,146.91 42.38,147.22 38.48,147.22 37.75,147.96 28.66,147.96 4Y_4.TP
+3.3V
  Top 0.152: R12.1 R11.1 R10.1 R9.1 R8.1 R7.1 R6.1 R5.1 R4.2 R3.2 R2.2 R1.2 63.26,4.45 96.44,4.45 JP1A.2
+5V
  Top 0.635: C5.1 63.26,58.42 U3.16 | C7.1 62.95,73.66 U4.16 | C1.1 62.95,89.22 U1.16 | C3.1 62.95,104.78 U2.16 | U$4.3 C30.+ 11.51,112.39 11.51,103.82 +5V.TP
  Bottom 0.635: C30.+ 21.99,115.25 55.01,115.25 64.22,106.05 C3.1 67.07,100.65 67.07,90.81 | 67.07,90.81 C1.1 | 67.07,90.81 67.07,75.31 67.04,75.28 | 67.04,75.28 C7.1 | 67.04,75.28 67.04,59.66 C5.1 67.07,54.61 67.07,46.99 64.53,44.45 35.32,44.45 32.07,41.2 32.07,16.07 JP2A.5 JP2A.3 JP2A.1
+12V
  Top 0.381: C28.+ 5.48,118.43 5.79,118.43
  Top 0.635: C6.1 39.13,50.8 U3.8 | C8.1 38.81,66.04 U4.8 | C2.1 39.13,81.6 U1.8 | C4.1 38.81,97.16 U2.8 | U$6.3 C28.+ | 5.79,118.43 10.24,113.98 10.24,105.41 7.7,102.87 +12V.TP
  Bottom 0.635: C28.+ 26.11,98.42 C4.1 39.13,96.84 39.13,84.14 C2.1 39.13,81.6 39.13,68.9 C8.1 39.13,65.72 39.13,53.34 C6.1
+15V
  Top 0.635: 7.54,141.45 4.07,144.92 J1.3 7.07,153.5 J1.2 | 7.54,141.45 C27.+ 8.02,135.89 | 7.54,141.45 20.24,141.45 C29.+ 20.72,135.89 U$4.2 | 8.02,135.89 U$6.2 | 8.02,135.89 3.25,131.13 3.25,110.17 +15V.TP
EN  (via drill 0.35)
  Top 0.152: U3.9 42.31,60.64 41.04,61.91 v36.91,61.91 | U4.9 42.31,75.88 40.09,78.11 v36.91,78.11 | U1.9 40.09,91.44 v37.23,91.44 | U2.9 42.23,104.78 40.01,107 36.83,107 32.7,102.87 v32.7,92.08
  Bottom 0.152: U3.1 55.64,55.24 45.48,55.24 U3.9 | U4.1 56.59,69.53 46.44,69.53 U4.9 | U1.1 56.28,85.41 46.12,85.41 U1.9 | U2.1 56.59,100.65 46.44,100.65 U2.9 | 33.73,87.95 33.73,79.69 | 33.73,79.69 33.73,65.09 v36.91,61.91 36.2,61.91 30.28,56 JP2B.3 | v36.91,78.11 35.32,78.11 33.73,79.69 | v37.23,91.44 33.73,87.95 | v32.7,92.08 32.7,88.98 33.73,87.95
GND  (via drill 0.35)
  other vias: 118.43,162.88 118.11,151.76 117.79,140.65 117.79,120.97 117.79,130.49 117.79,108.58 117.79,96.2 117.16,84.45 116.84,72.71 117.16,57.47 117.16,42.55 117.16,27.94 117.79,13.97 117.79,2.22 105.09,1.91 92.39,1.59 79.69,1.59 69.22,1.59 60.33,1.91 51.12,1.59 40.64,1.91 29.84,1.91 21.27,1.91 12.38,2.22 1.91,2.22 1.91,13.65 1.91,25.08 1.91,37.78 1.91,49.85 1.59,62.87 1.91,75.25 1.91,86.68 1.91,97.79 1.91,107.63 1.59,120.33 1.91,132.4 1.59,141.29 1.59,155.89 1.59,163.19 12.06,163.19 24.13,163.51 35.88,163.19 47.94,163.19 61.91,163.19 76.52,163.19 88.27,163.19 100.33,163.19 110.49,162.88 29.84,148.91 35.56,149.22 40.01,149.22 45.09,149.22 50.8,148.91 55.88,149.22 61.91,147.96 66.99,147.96 77.15,137.48 72.39,141.92 75.25,145.1 71.12,148.59 79.38,140.34 81.28,143.19 77.15,147.64 83.82,147.64 87.63,148.27 87.63,140.02 92.08,147.64 92.39,140.97 89.85,134.3 97.47,147.32 97.47,140.34 25.4,148.91 32.07,146.05 38.73,145.73 45.4,145.1 53.66,144.46 61.28,139.7 66.04,134.62 67.63,127 70.17,119.06 70.17,111.12 67.31,110.49 60.64,112.71 53.66,116.84 42.23,117.16 31.75,117.47 26.35,117.16 20.32,122.24 26.99,128.91 25.4,134.94 24.13,142.88 14.92,143.51 6.99,145.41 11.43,155.57 13.97,139.7 10.48,132.08 18.1,132.4 16.51,125.09 14.61,118.11 7.3,125.41 7.94,120.33 5.08,115.89 7.94,110.81 13.65,108.58 19.37,102.55 14.92,112.08 22.54,105.09 26.04,113.35 40.64,113.03 52.7,112.71 57.47,109.86 47.31,107.63 36.2,108.58 27.62,108.58 28.57,104.78 36.51,105.41 34.61,100.65 27.94,100.65 24.77,96.84 32.07,96.84 17.78,95.57 21.91,88.9 20.64,86.04 16.51,81.6 11.43,81.92 10.48,86.36 10.79,88.9 12.06,77.47 9.21,72.07 23.81,81.92 18.41,76.52 13.02,71.75 10.79,65.41 16.51,70.8 22.86,77.15 22.23,69.53 17.14,66.36 12.7,59.69 23.5,65.72 17.14,55.56 12.06,49.53 18.1,48.26 11.43,41.59 11.43,36.2 17.78,42.55 19.05,38.1 12.7,32.07 11.43,26.04 18.73,33.02 19.37,28.57 11.75,21.27 20.64,24.77 11.11,14.92 12.38,11.11 17.14,16.19 22.54,21.91 22.86,15.88 23.18,9.84 23.81,30.48 23.81,40.96 29.84,45.4 29.53,35.88 29.53,26.35 29.53,19.05 29.53,11.43 26.04,5.71 24.77,47.62 34.61,47.31 42.23,46.35 39.69,49.21 40.32,52.7 46.99,48.58 53.02,45.72 62.87,46.35 37.15,42.55 46.35,42.23 58.74,42.55 38.73,6.03 50.48,6.67 58.1,6.99 59.05,14.92 57.78,23.18 58.42,32.7 58.1,37.78 99.69,6.35 92.39,5.71 80.01,5.4 80.01,7.62 73.34,7.94 73.03,10.79 80.96,10.48 80.33,13.34 74.3,13.02 73.66,16.51 80.96,16.83 88.27,19.68 98.42,13.02 97.79,9.21 87,8.89 80.96,20 73.98,20 73.34,24.13 80.64,23.81 80.96,26.99 73.34,26.99 73.34,29.21 80.64,28.89 64.45,9.21 64.45,12.38 63.82,20.32 65.72,29.53 66.04,37.47 73.03,32.7 80.01,33.02 73.98,36.83 73.34,39.05 80.01,39.05 66.04,41.27 76.2,41.91 84.45,41.59 97.47,46.35 104.46,8.89 104.78,15.56 104.14,23.5 104.46,30.16 104.46,37.15 104.14,43.81 72.71,44.77 81.6,44.45 89.22,45.4 96.2,49.53 102.23,49.53 97.79,54.93 97.79,64.14 97.79,72.07 97.16,81.28 97.79,89.85 101.92,94.93 103.82,87.63 103.82,76.52 103.82,66.99 104.14,57.15 80.01,51.12 88.9,59.69 92.08,72.71 92.08,86.04 92.08,99.06 92.39,110.81 92.08,121.6 92.08,128.59 68.9,105.73 72.71,107 70.17,100.33 64.14,96.2 59.69,101.6 52.39,102.55 43.81,101.6 46.35,98.74 52.39,99.06 53.34,94.93 53.02,91.44 46.99,91.12 48.9,93.34 45.09,94.93 37.15,96.2 41.59,92.08 40.64,87.63 35.24,86.68 36.83,80.33 36.2,73.98 43.5,76.52 48.58,77.47 44.13,79.38 32.07,77.47 36.51,65.41 46.67,62.55 33.02,62.55 47.94,56.52 52.7,56.2 45.4,53.34 52.39,53.34 53.02,49.21 57.78,56.2 62.23,53.02 67.94,57.47 68.58,51.12 73.98,53.02 79.06,58.1 72.71,58.1 53.34,64.14 53.02,60.01 45.72,67.94 52.7,68.26 43.81,70.17 47.62,71.44 52.39,71.75 58.42,70.8 62.55,70.17 62.23,65.09 69.85,65.09 78.11,65.41 82.55,68.9 82.87,73.66 82.55,78.11 77.47,73.98 71.75,73.98 68.9,69.53 64.45,74.61 47.31,87.31 53.34,87.31 53.66,83.5 46.35,83.5 43.5,86.04 58.74,86.68 62.23,80.96 68.58,80.96 74.93,81.92 77.47,87 77.47,92.71 77.47,96.84 73.66,92.39 70.17,89.53 68.9,85.09 64.45,90.17 11.43,99.06 33.66,39.69 33.34,33.02 33.97,25.4 33.97,16.19 16.51,48.26 20,58.42 22.86,62.87 20.95,73.98 12.38,63.18 14.61,53.02 16.51,36.83 14.61,25.08 24.13,52.39 69.53,3.17 74.61,3.17 79.38,3.17 86.04,3.17 95.57,3.49 100.97,3.81 95.25,27.3 95.57,25.08 95.89,22.54 95.89,20.32 96.2,18.1 96.2,15.56 96.52,13.34 95.57,9.53 89.22,12.06 88.9,14.61 88.58,17.14 88.58,22.54 87.95,26.04 87.31,28.89 93.98,28.57 96.2,35.56 98.42,40.96 94.93,40.64 99.06,17.14 95.57,132.4 100.97,137.79 100.97,144.78
  pour Top: 1,1 119,1 119,164 1,164
  pour Bottom: 1,1 119,1 119,164 1,164
N$1
  Top 0.152: R11.2 79.06,37.47 80.01,36.51 89.58,36.51 S1.2 95.93,42.86 100.86,42.86 JP1A.37
N$2
  Top 0.152: R12.2 80.01,40.64 81.28,39.37 89.9,39.37 S1.1 95.61,45.09 101.08,45.09 JP1A.39
N$3
  Top 0.152: R10.2 89.9,34.29 S1.3 94.66,39.05 101.05,39.05 JP1A.33
N$4
  Top 0.152: R9.2 89.26,31.11 S1.4 95.01,36.86 100.86,36.86 JP1A.31
N$5
  Top 0.152: R1.1 89.3,6.35 S2.8 92.71,8.26 98.11,13.65 98.11,19.68 99.38,20.95 100.97,20.95 JP1A.15
N$6
  Top 0.152: R2.1 87.31,9.53 88.58,10.79 S2.7 91.44,10.79 92.71,10.79 97.79,15.88 97.79,21.59 99.06,22.86 100.36,22.86 100.86,22.86 JP1A.17
N$7
  Top 0.152: R3.1 87.31,12.38 88.27,13.34 S2.6 91.44,13.34 92.71,13.34 97.47,18.1 97.47,23.5 99.06,25.08 101.08,25.08 JP1A.19
N$8
  Top 0.152: R4.1 79.69,15.24 80.33,14.61 87.31,14.61 88.58,15.88 S2.5 92.71,15.88 97.16,20.32 97.16,25.08 99.06,26.99 100.99,26.99 JP1A.21
N$9
  Top 0.152: R5.2 80.64,18.41 81.92,17.14 85.41,17.14 86.68,18.41 S2.4 92.71,18.41 96.84,22.54 96.84,26.06 99.67,28.89 100.89,28.89 JP1A.23
N$10
  Top 0.152: R6.2 77.47,21.59 78.11,22.23 87.31,22.23 88.54,21 91.16,21 S2.3 92.71,20.95 96.52,24.77 96.52,28.57 99.06,31.11 101.11,31.11 JP1A.25
N$11
  Top 0.152: R7.2 87.31,24.77 88.54,23.54 91.16,23.54 S2.2 92.71,23.5 96.2,26.99 96.2,30.8 98.42,33.02 101.02,33.02 JP1A.27
N$12
  Top 0.152: R8.2 89.3,27.94 S2.1 93.03,26.04 95.89,28.89 95.89,32.7 98.13,34.95 100.94,34.95 | 100.92,34.92 100.94,34.95 | 100.94,34.95 JP1A.29
(copper drawn outside any net)
  shapes: Top area x5